# EAGLE design main (EAGLE 9.5.1)
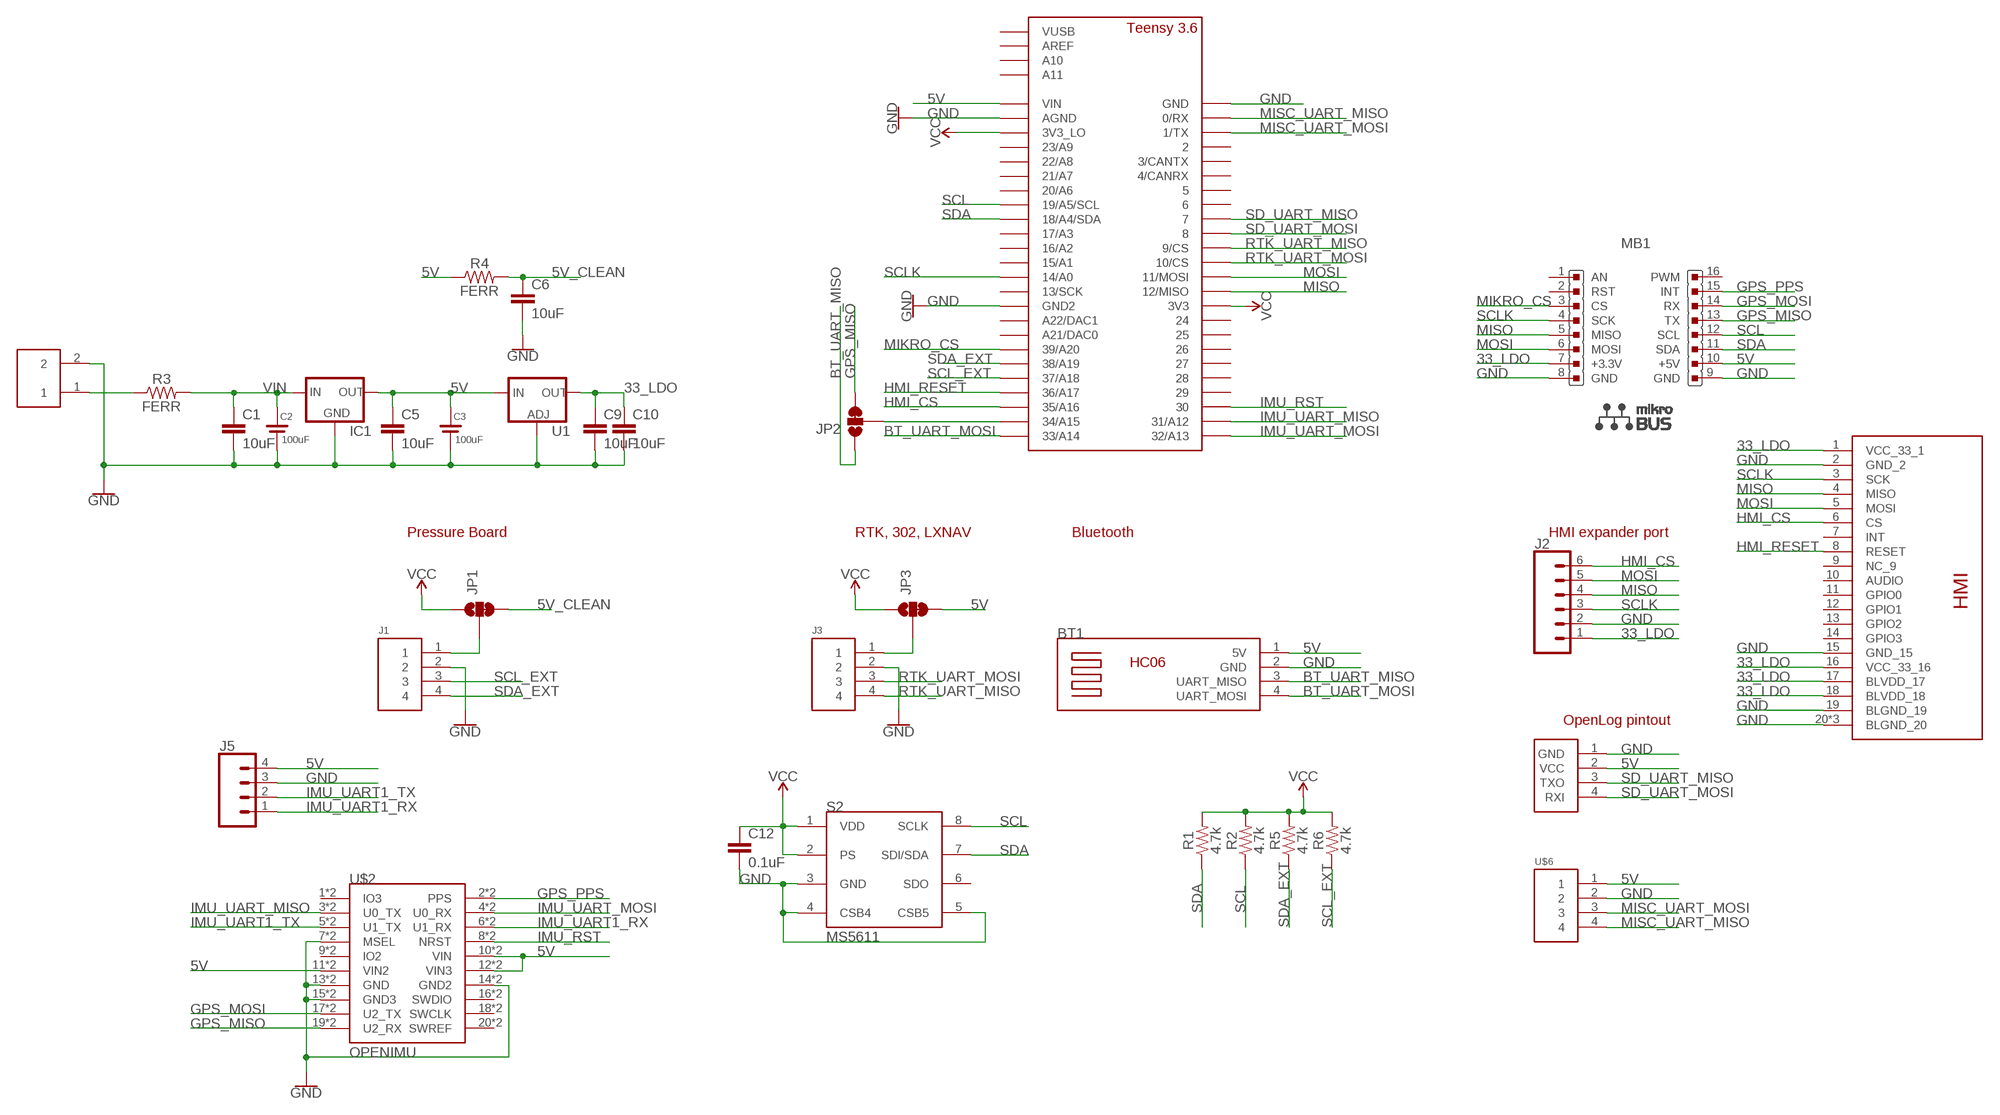
[diagram p0: schematic, sheet 1]

## Parts
BT1  HC06  [HC06]
C1  10uF  10UF-1206-6.3V-20%  [1206]
C2  100uF  CAP_POLARCAP_8_DIA_35_LEAD  [CAP_8MM_35MM]
C3  100uF  CAP_POLARCAP_8_DIA_35_LEAD  [CAP_8MM_35MM]
C5  10uF  10UF-1206-6.3V-20%  [1206]
C6  10uF  10UF-1206-6.3V-20%  [1206]
C9  10uF  10UF-1206-6.3V-20%  [1206]
C10  10uF  10UF-1206-6.3V-20%  [1206]
C12  0.1uF  0.1UF-0603-25V-5%  [0603]
IC1  V_REG_78XXR-78E  [V78W]
J1  HEADER4VALULOK  [4PINVALULOK]
J2  CONN_06SILK_FEMALE_PTH  [1X06]
J3  HEADER4VALULOK  [4PINVALULOK]
J5  CONN_04SMD_RA_FEMALE  [1X04_SMD_RA_FEMALE]
J_PWR  HEADER2  [2PINVALULOK]
JP1  JUMPER-SMT_3_1-NC_TRACE_SILK  [SMT-JUMPER_3_1-NC_TRACE_SILK]
JP2  JUMPER-SMT_3_1-NC_TRACE_NO-SILK  [SMT-JUMPER_3_1-NC_TRACE_NO-SILK]
JP3  JUMPER-SMT_3_1-NC_TRACE_SILK  [SMT-JUMPER_3_1-NC_TRACE_SILK]
MB1  MIKROBUS  [MIKROBUS]
R1  4.7k  4.7KOHM-0603-1/10W-1%  [0603]
R2  4.7k  4.7KOHM-0603-1/10W-1%  [0603]
R3  FERR  RESISTOR1206  [1206]
R4  FERR  RESISTOR1206  [1206]
R5  4.7k  4.7KOHM-0603-1/10W-1%  [0603]
R6  4.7k  4.7KOHM-0603-1/10W-1%  [0603]
S2  MS5611  [MS5611]
U1  V_REG_317SMD  [SOT223]
U$1  TEENSY_3.5/3.6_BASIC  [TEENSY_3.5/3.6_BASIC]
U$2  OPENIMU  [OPENIMU300ZA]
U$4  OPENLOG  [OPENLOG]
U$5  RIVERDI-MATRIX-HMI  [FFC-20]
U$6  HEADER4VALULOK  [4PINVALULOK]

## Nets
5V: BT1.1(5V) C3.POS(+) C5.1 IC1.OUT J5.4 JP3.3 MB1.10(+5V) R4.1 U1.3(IN) U$1.VIN U$2.10(VIN) U$2.11(VIN2) U$2.12(VIN3) U$2.H10(VIN) U$2.H11(VIN2) U$2.H12(VIN3) U$4.2(VCC) U$6.1
5V_CLEAN: C6.1 JP1.3 R4.2
33_LDO: C9.1 C10.1 J2.1 MB1.7(+3.3V) U1.2(OUT) U$5.1(VCC_33_1) U$5.16(VCC_33_16) U$5.17(BLVDD_17) U$5.18(BLVDD_18)
BT_UART_MISO: BT1.3(UART_MISO) JP2.1
BT_UART_MOSI: BT1.4(UART_MOSI) U$1.33/A14
GND: BT1.2(GND) C1.2 C2.NEG(-) C3.NEG(-) C5.2 C6.2 C9.2 C10.2 C12.2 IC1.GND J1.2 J2.2 J3.2 J5.3 J_PWR.2 MB1.8(GND) MB1.9(GND) S2.3(GND) S2.4(CSB4) S2.5(CSB5) U1.1(ADJ) U$1.AGND U$1.GND U$1.GND2 U$2.7(MSEL) U$2.13(GND) U$2.14(GND2) U$2.15(GND3) U$2.H7(MSEL) U$2.H13(GND) U$2.H14(GND2) U$2.H15(GND3) U$4.1(GND) U$5.2(GND_2) U$5.15(GND_15) U$5.19(BLGND_19) U$5.20(BLGND_20) U$5.PAD1(BLGND_20) U$5.PAD2(BLGND_20) U$6.2
GPS_MISO: JP2.3 MB1.13(TX) U$2.19(U2_RX) U$2.H19(U2_RX)
GPS_MOSI: MB1.14(RX) U$2.17(U2_TX) U$2.H17(U2_TX)
GPS_PPS: MB1.15(INT) U$2.2(PPS) U$2.H2(PPS)
HMI_CS: J2.6 U$1.35/A16 U$5.6(CS)
HMI_RESET: U$1.36/A17 U$5.8(RESET)
IMU_RST: U$1.30 U$2.8(NRST) U$2.H8(NRST)
IMU_UART1_RX: J5.1 U$2.6(U1_RX) U$2.H6(U1_RX)
IMU_UART1_TX: J5.2 U$2.5(U1_TX) U$2.H5(U1_TX)
IMU_UART_MISO: U$1.31/A12 U$2.3(U0_TX) U$2.H3(U0_TX)
IMU_UART_MOSI: U$1.32/A13 U$2.4(U0_RX) U$2.H4(U0_RX)
MIKRO_CS: MB1.3(CS) U$1.39/A20
MISC_UART_MISO: U$1.0/RX U$6.4
MISC_UART_MOSI: U$1.1/TX U$6.3
MISO: J2.4 MB1.5(MISO) U$1.12/MISO U$5.4(MISO)
MOSI: J2.5 MB1.6(MOSI) U$1.11/MOSI U$5.5(MOSI)
N$1: J_PWR.1 R3.1
N$2: J1.1 JP1.2
N$3: J3.1 JP3.2
N$4: JP2.2 U$1.34/A15
RTK_UART_MISO: J3.4 U$1.9/CS
RTK_UART_MOSI: J3.3 U$1.10/CS
SCL: MB1.12(SCL) R2.1 S2.8(SCLK) U$1.19/A5/SCL
SCL_EXT: J1.3 R6.1 U$1.37/A18
SCLK: J2.3 MB1.4(SCK) U$1.14/A0 U$5.3(SCK)
SD_UART_MISO: U$1.7 U$4.3(TXO)
SD_UART_MOSI: U$1.8 U$4.4(RXI)
SDA: MB1.11(SDA) R1.1 S2.7(SDI/SDA) U$1.18/A4/SDA
SDA_EXT: J1.4 R5.1 U$1.38/A19
VCC: C12.1 JP1.1 JP3.1 R1.2 R2.2 R5.2 R6.2 S2.1(VDD) S2.2(PS) U$1.3V3 U$1.3V3_LO
VIN: C1.1 C2.POS(+) IC1.IN R3.2
Unconnected: MB1.1(AN) MB1.2(RST) MB1.16(PWM) S2.6(SDO) U$1.2 U$1.3/CANTX U$1.4/CANRX U$1.5 U$1.6 U$1.13/SCK U$1.15/A1 U$1.16/A2 U$1.17/A3 U$1.20/A6 U$1.21/A7 U$1.21/DAC0(A21/DAC0) U$1.22/A8 U$1.23/A9 U$1.24 U$1.25 U$1.26 U$1.27 U$1.28 U$1.29 U$1.A10 U$1.A11 U$1.A22/DAC1 U$1.AREF U$1.VUSB U$2.1(IO3) U$2.9(IO2) U$2.16(SWDIO) U$2.18(SWCLK) U$2.20(SWREF) U$2.H1(IO3) U$2.H9(IO2) U$2.H16(SWDIO) U$2.H18(SWCLK) U$2.H20(SWREF) U$5.7(INT) U$5.9(NC_9) U$5.10(AUDIO) U$5.11(GPIO0) U$5.12(GPIO1) U$5.13(GPIO2) U$5.14(GPIO3)

## Notes on the sheet
- Pressure Board | RTK, 302, LXNAV | Bluetooth | HMI expander port
- OpenLog pintout

## Library data of the parts
BT1 = 2020:HC06
C1 C5 C6 C9 C10 = SparkFun-Capacitors:10UF: 10.0µF ceramic capacitors A capacitor is a passive two-terminal electrical component used to store electrical energy temporarily in an electric field.; PROD_ID: CAP-10057
C2 C3 = 2020:CAP_POLAR
C12 = SparkFun-Capacitors:0.1UF: 0.1µF ceramic capacitors A capacitor is a passive two-terminal electrical component used to store electrical energy temporarily in an electric field.; PROD_ID: CAP-08604
IC1 = 2018:V_REG_78XX: Voltage Regulator Standard 7805 5V regulator. IGO (Input Ground Output). Spark Fun Electronics SKU : COM-00107
J1 J3 U$6 = Custom_old:HEADER4
J2 = SparkFun-Connectors:CONN_06: Multi connection point. Often used as Generic Header-pin footprint for 0.1 inch spaced/style header connections On any of the 0.1 inch spaced packages, you can populate with these: Break Away Headers - Straight <https://www.sparkfun.com/products/116> (PRT-00116) Break Away Male Headers - Right Angle <https://www.sparkfun.com/products/553> (PRT-00553) Female Headers <https://www.sparkfun.com/products/115> (PRT-00115) Break Away Headers - Machine Pin <https://www.sparkfun.com/products/117> (PRT-00117) Break Away Female Headers - Swiss Machine Pin <https://www.sparkfun.com/products/743> (PRT-00743) Arduino Stackable Header - 6 Pin <https://www.sparkfun.com/products/9280> (PRT-09280) For SCREWTERMINALS and SPRING TERMINALS visit here: Screw Terimnals on SparkFun.com <https://www.sparkfun.com/search/results?term=Screw+Terminals> (5mm/3.5mm/2.54mm spacing) This device is also useful as a general connection point to wire up your design to another part of your project. Our various solder wires solder well into these plated through hole pads. Hook-Up Wire - Assortment (Stranded, 22 AWG) <https://www.sparkfun.com/products/11375> (PRT-11375) Hook-Up Wire - Assortment (Solid Core, 22 AWG) <https://www.sparkfun.com/products/11367> (PRT-11367) View the entire wire category on our website here <https://www.sparkfun.com/categories/141>; PROD_ID: CONN-08437
J5 = SparkFun-Connectors:CONN_04: Multi connection point. Often used as Generic Header-pin footprint for 0.1 inch spaced/style header connections On any of the 0.1 inch spaced packages, you can populate with these: Break Away Headers - Straight <https://www.sparkfun.com/products/116> (PRT-00116) Break Away Male Headers - Right Angle <https://www.sparkfun.com/products/553> (PRT-00553) Female Headers <https://www.sparkfun.com/products/115> (PRT-00115) Break Away Headers - Machine Pin <https://www.sparkfun.com/products/117> (PRT-00117) Break Away Female Headers - Swiss Machine Pin <https://www.sparkfun.com/products/743> (PRT-00743) For SCREWTERMINALS and SPRING TERMINALS visit here: Screw Terimnals on SparkFun.com <https://www.sparkfun.com/search/results?term=Screw+Terminals> (5mm/3.5mm/2.54mm spacing) This device is also useful as a general connection point to wire up your design to another part of your project. Our various solder wires solder well into these plated through hole pads. Hook-Up Wire - Assortment (Stranded, 22 AWG) <https://www.sparkfun.com/products/11375> (PRT-11375) Hook-Up Wire - Assortment (Solid Core, 22 AWG) <https://www.sparkfun.com/products/11367> (PRT-11367) View the entire wire category on our website here <https://www.sparkfun.com/categories/141> Special notes: Molex polarized connector foot print use with SKU : PRT-08231 with associated crimp pins and housings. 1MM SMD Version SKU: PRT-10208; PROD_ID: CONN-12382
J_PWR = Custom_old:HEADER2
JP1-JP3 = SparkFun-Jumpers:JUMPER-SMT_3_1-NC_TRACE: Normally closed trace jumper (1 of 2 connections) This jumper has a trace between two pads so it's normally closed (NC). The other connection is normally open (NO). Use a razor knife to open the connection. For best results follow the IPC guidelines for cutting traces: Cutout at least 0.063 mm (0.005 in). Remove all loose material to clean up the cut area. Seal the cut with an approved epoxy. Reapply solder to reclose the connection, or to close the NO connection.
MB1 = MikroBUS:MIKROBUS: MikroBUS Source: MikroBUS specification <http://www.mikroe.com/downloads/get/1737/mikrobus_specification.pdf> MikroBUS <http://www.mikroe.com/mikrobus/>
R1 R2 R5 R6 = SparkFun-Resistors:4.7KOHM: 4.7kΩ resistor A resistor is a passive two-terminal electrical component that implements electrical resistance as a circuit element. Resistors act to reduce current flow, and, at the same time, act to lower voltage levels within circuits. - Wikipedia; PROD_ID: RES-07857
R3 R4 = SparkFun-Resistors:RESISTOR: Generic Resistor Package
S2 = Custom_old:MS5611
U1 = SparkFun-IC-Power:V_REG_317: Voltage Regulator Standard LM317 adjustable voltage regulator. AOI (Adjust Output Input). Google 'LM317 Calculator' for easy to use app to get the two resistor values needed. 240/720 for 5V output. 240/390 for 3.3V output. Spark Fun Electronics SKU : COM-00527
U$1 = Teensy356:TEENSY_3.5/3.6_BASIC
U$2 = 2020:OPENIMU
U$4 = 2020:OPENLOG
U$5 = 2020:RIVERDI-MATRIX-HMI

## Board
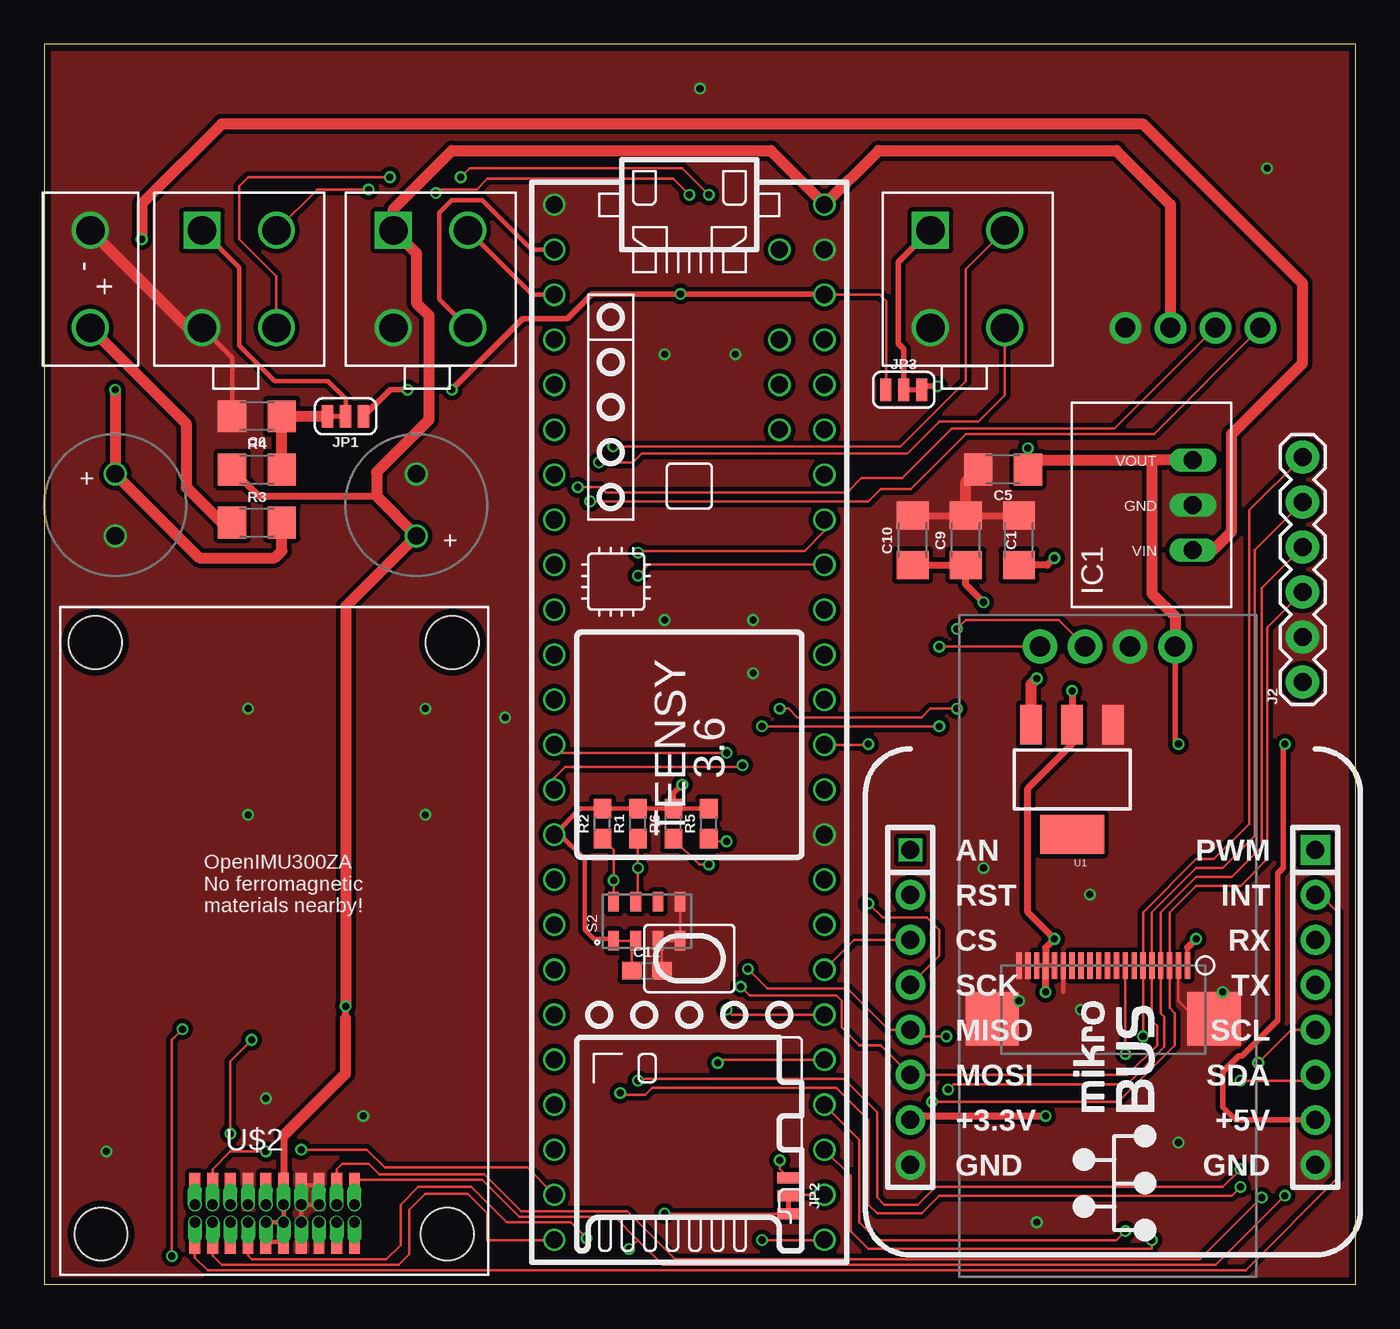
[diagram p1: board, top side]
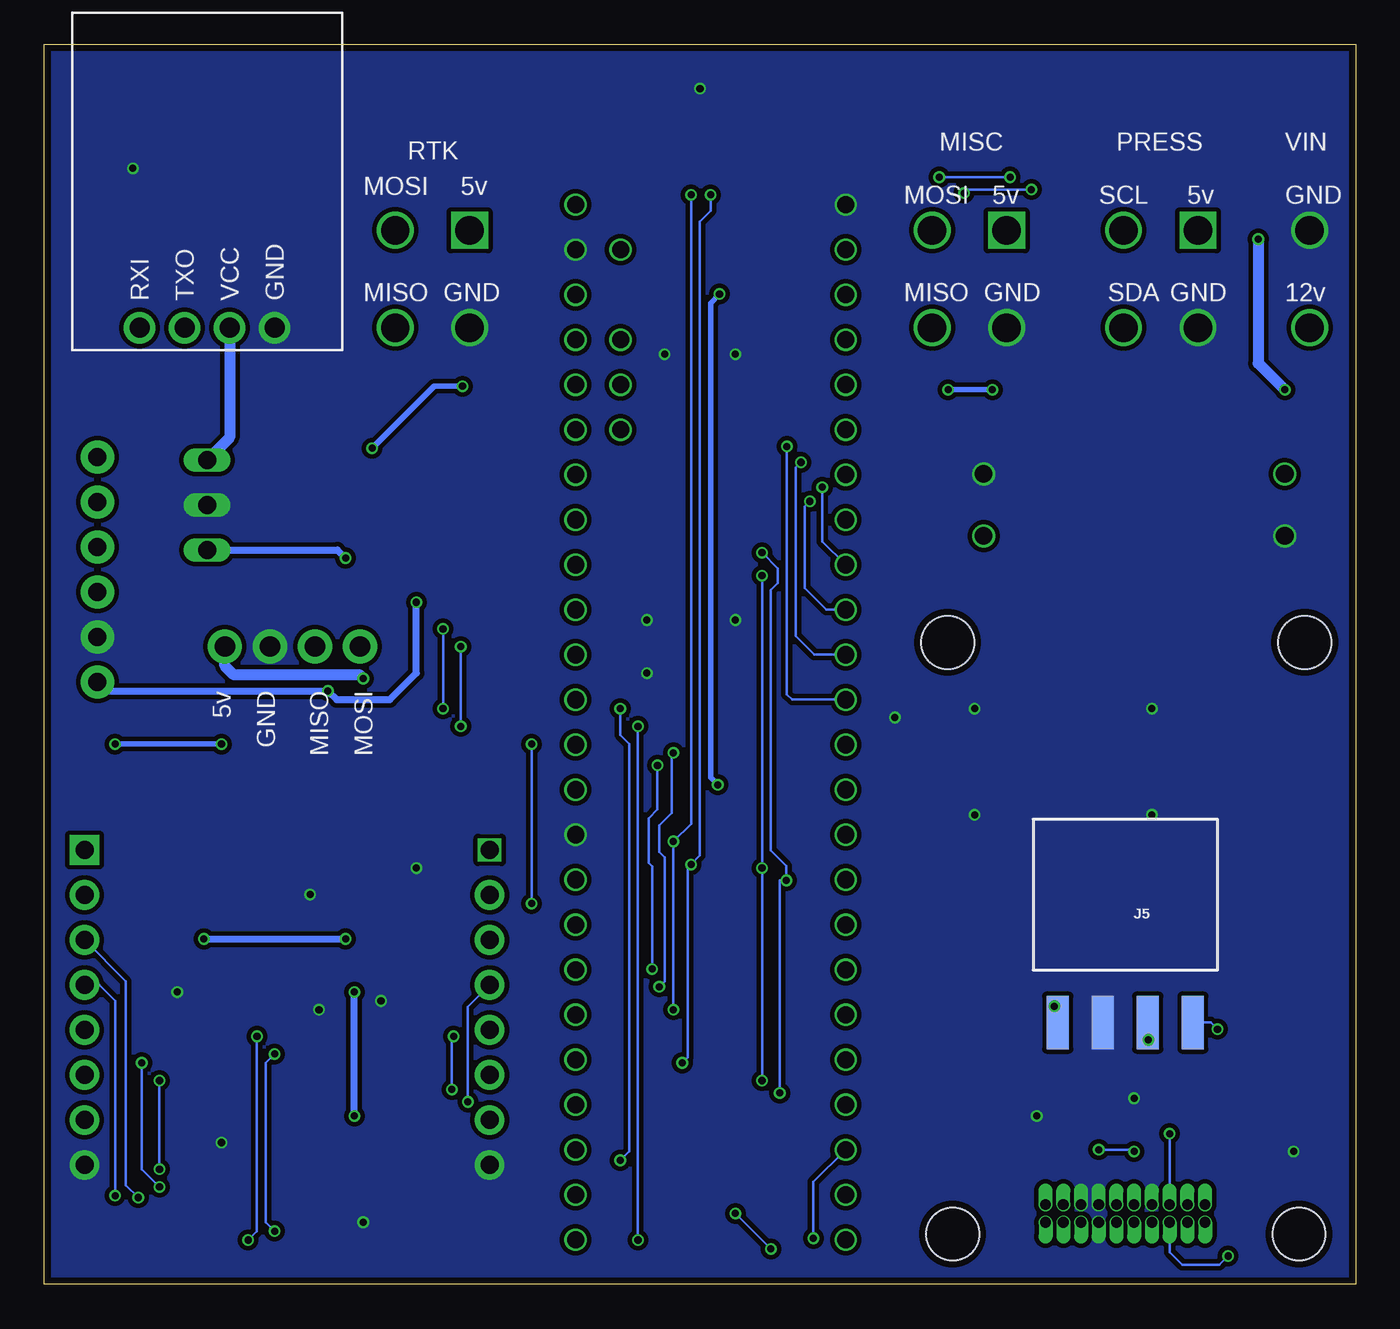
[diagram p2: board, bottom side, seen from below]

Size 74 x 70 mm. Coordinates in mm from the lower left corner, seen from the top.
Outline: 0,0 74,0 74,70 0,70 0,0
Copper layers (1*16): Top 0.035559375mm / dielectric 1.6mm / Bottom 0.035559375mm
Design rules "PATRICK-2lyr": minimum track width 6mil, minimum drill 10mil, track to track 6mil, track to pad 6mil, pad to pad 6mil, via to via 6mil, smd to smd 6mil, copper to edge 15mil, drill to drill 6mil, minimum pad ring 4mil, minimum via ring 5mil, stop-mask expansion 2.5mil, vias tented up to drill 25mil, thermal gap 10mil

### Footprints (pad centres in the part's own frame; a part is rotated, then mirrored left to right if it is on the bottom)
HC06 = drill 1.143 pad 1.93: 1 -3.81,0; 2 -1.27,0; 3 1.27,0; 4 3.81,0
1206 = smd 1.6 x 1.8: 1 -1.4,0; 2 1.4,0
CAP_8MM_35MM = drill 1: NEG 0,-1.75; POS 0,1.75
0603 = smd 1.1 x 1: 1 -0.85,0; 2 0.85,0
V78W = drill 1.016 long: GND 0,-3.81; IN -2.54,-3.81; OUT 2.54,-3.81
4PINVALULOK = drill 1.6 square: 1 0,5.5 | drill 1.6: 2 0,0; 3 4.2,5.5; 4 4.2,0
1X06 = drill 1.016 pad 1.88: 1 0,0; 2 2.54,0; 3 5.08,0; 4 7.62,0; 5 10.16,0; 6 12.7,0
1X04_SMD_RA_FEMALE = smd 1.25 x 3: 1 -3.81,7.225; 2 -1.27,7.225; 3 1.27,7.225; 4 3.81,7.225
2PINVALULOK = drill 1.6: 1 0,5.5; 2 0,0
SMT-JUMPER_3_1-NC_TRACE_SILK = smd 0.635 x 1.27: 1 -1.016,0; 2 0,0; 3 1.016,0
SMT-JUMPER_3_1-NC_TRACE_NO-SILK = smd 0.635 x 1.27: 1 -1.016,0; 2 0,0; 3 1.016,0
MIKROBUS = drill 1.016 square: 1 -11.43,7.62 | drill 1.016 pad 1.676: 2 -11.43,5.08; 3 -11.43,2.54; 4 -11.43,0; 5 -11.43,-2.54; 6 -11.43,-5.08; 7 -11.43,-7.62; 8 -11.43,-10.16; 9 11.43,-10.16; 10 11.43,-7.62; 11 11.43,-5.08; 12 11.43,-2.54; 13 11.43,0; 14 11.43,2.54; 15 11.43,5.08 | drill 1.016 pad 1.676 square: 16 11.43,7.62
MS5611 = smd 1.1 x 0.6: 1 -1.1,1.875; 2 -1.1,0.625; 3 -1.1,-0.625; 4 -1.1,-1.875; 5 1.1,-1.875; 6 1.1,-0.625; 7 1.1,0.625; 8 1.1,1.875
SOT223 = smd 1.219 x 2.235: 1 -2.311,-3.099; 2 0,-3.099; 3 2.311,-3.099 | smd 3.6 x 2.2: 4 0,3.099
TEENSY_3.5/3.6_BASIC = drill 0.965: 0/RX -25.4,-7.62; 1/TX -22.86,-7.62; 2 -20.32,-7.62; 3/CANTX -17.78,-7.62; 3V3 7.62,-7.62; 3V3_LO -22.86,7.62; 4/CANRX -15.24,-7.62; 5 -12.7,-7.62; 6 -10.16,-7.62; 7 -7.62,-7.62; 8 -5.08,-7.62; 9/CS -2.54,-7.62; 10/CS 0,-7.62; 11/MOSI 2.54,-7.62; 12/MISO 5.08,-7.62; 13/SCK 5.08,7.62; 14/A0 2.54,7.62; 15/A1 0,7.62; 16/A2 -2.54,7.62; 17/A3 -5.08,7.62; 18/A4/SDA -7.62,7.62; 19/A5/SCL -10.16,7.62; 20/A6 -12.7,7.62; 21/A7 -15.24,7.62; 21/DAC0 12.7,7.62; 22/A8 -17.78,7.62; 23/A9 -20.32,7.62; 24 10.16,-7.62; 25 12.7,-7.62; 26 15.24,-7.62; 27 17.78,-7.62; 28 20.32,-7.62; 29 22.86,-7.62; 30 25.4,-7.62; 31/A12 27.94,-7.62; 32/A13 30.48,-7.62; 33/A14 30.48,7.62; 34/A15 27.94,7.62; 35/A16 25.4,7.62; 36/A17 22.86,7.62; 37/A18 20.32,7.62; 38/A19 17.78,7.62; 39/A20 15.24,7.62; A10 -17.78,5.08; A11 -15.24,5.08; A22/DAC1 10.16,7.62; AGND -25.4,7.62; AREF -20.32,5.08; GND -27.94,-7.62; GND2 7.62,7.62; VIN -27.94,7.62; VUSB -25.4,5.08
OPENIMU300ZA = smd 0.61 x 1.372: 1 -4.503,1.6; 2 -4.503,-1.6; 3 -3.503,1.6; 4 -3.503,-1.6; 5 -2.502,1.6; 6 -2.502,-1.6; 7 -1.501,1.6; 8 -1.501,-1.6; 9 -0.5,1.6; 10 -0.5,-1.6; 11 0.5,1.6; 12 0.5,-1.6; 13 1.501,1.6; 14 1.501,-1.6; 15 2.502,1.6; 16 2.502,-1.6; 17 3.503,1.6; 18 3.503,-1.6; 19 4.503,1.6; 20 4.503,-1.6 | drill 0.6 pad 0.7 offset: H1 -4.5,0.5; H2 -4.5,-0.5; H3 -3.5,0.5; H4 -3.5,-0.5; H5 -2.5,0.5; H6 -2.5,-0.5; H7 -1.5,0.5; H8 -1.5,-0.5; H9 -0.5,0.5; H10 -0.5,-0.5; H11 0.5,0.5; H12 0.5,-0.5; H13 1.5,0.5; H14 1.5,-0.5; H15 2.5,0.5; H16 2.5,-0.5; H17 3.5,0.5; H18 3.5,-0.5; H19 4.5,0.5; H20 4.5,-0.5 | hole 3: 9.75,-1.16; -9.8,-1.16; -10.125,32.24; 10.025,32.24
OPENLOG = drill 1.143 pad 1.778: 1 0,0; 2 -2.54,0; 3 -5.08,0; 4 -7.62,0
FFC-20 = smd 0.3 x 1.5: 1 9.5,0; 2 9,0; 3 8.5,0; 4 8,0; 5 7.5,0; 6 7,0; 7 6.5,0; 8 6,0; 9 5.5,0; 10 5,0; 11 4.5,0; 12 4,0; 13 3.5,0; 14 3,0; 15 2.5,0; 16 2,0; 17 1.5,0; 18 1,0; 19 0.5,0; 20 0,0 | smd 3 x 3: PAD1 -1.5,-3; PAD2 11,-3

### Placement (x,y rotation side)
BT1  60,36 180 top
C1  55,42 90 top
C2  4,44 0 top
C3  21,44 180 top
C5  54.1,46 180 top
C6  12,49 180 top
C9  52,42 90 top
C10  49,42 90 top
C12  34,17.7 0 top
IC1  61,44 90 top
J1  8.9,54 0 top
J2  71,34 90 top
J3  50,54 0 top
J5  13,22 180 bottom
J_PWR  2.6,59.5 180 top
JP1  17,49 180 top
JP2  42,5 270 top
JP3  48.5,50.5 0 top
MB1  60.3,16.9 0 top
R1  33.5,26 90 top
R2  31.5,26 90 top
R3  12,43 0 top
R4  12,46 0 top
R5  37.5,26 90 top
R6  35.5,26 90 top
S2  34,20.5 90 top
U1  58,28.5 180 top
U$1  36.4,33 270 top
U$2  13,4 0 top
U$4  61,54 0 bottom
U$5  55,18 0 top
U$6  19.7,54 0 top

### Tracks (layer width: path | path; a pad name or v marks a point on that pad's centre or on a via)
5V  (via drill 0.4)
  Top 0.254: U$2.10 U$2.12 U$2.H12 | U$2.H11 13.5,5 U$2.11 | U$2.H11 | U$2.H11 U$2.H12 | U$2.H10 U$2.H12 | U$2.H12 | C5.1 55.5,46.54 56.04,46.54
  Top 0.305: 44.02,60.98 U$1.VIN | MB1.10 67.22,9.28 66.5,10 66.5,12 67.4,12.9 67.6,12.9 69.6,14.9 69.6,23.2 69.9,23.5 69.9,30.4 v70,30.5 | v64,30.5 63.81,30.69 BT1.1 | JP3.3 49.72,50.7 v50.4,50.7 | v55.5,47.2 C5.1
  Top 0.406: R4.1 12.1,44.5 18.75,44.5 | 13.5,8.4 13.5,5 | 13.5,5 | 17,15 v17,15.7
  Top 0.61: 44.02,60.98 41,64 23,64 19.7,60.7 U$6.1 21,58.2 21,55.4 21.7,54.7 21.7,48.8 18.75,45.85 18.75,44.5 C3.POS 17,38.25 v17,15.7 | 13.5,8.4 17,11.9 17,15 | IC1.OUT 62.54,46.54 | 62.54,46.54 62.5,46.5 62.5,39 63.81,37.69 BT1.1 | U1.3 55.69,33.89 v56,34.2 | U$1.VIN 47.08,64 60.5,64 63.54,60.96 U$4.2 | 56.04,46.54 62.54,46.54
  Bottom 0.305: v70,30.5 v64,30.5 | v50.4,50.7 52,50.7 v55.5,47.2
  Bottom 0.406: J5.4 16.81,15.51 v17,15.7
  Bottom 0.61: v56,34.2 56.2,34.4 63.3,34.4 63.81,34.91 BT1.1 | U$4.2 63.54,47.81 IC1.OUT
5V_CLEAN
  Top 0.61: R4.2 C6.1 JP1.3
33_LDO  (via drill 0.4)
  Top 0.254: U$5.16 U$5.17 U$5.18 | U$5.1 64.5,19 | 58,30.5 58,31.5 U1.2
  Top 0.406: MB1.7 49.09,9.5 v56.5,9.5 | v56.5,16.5 U$5.17 56.5,19 v57,19.5 55.5,21 55.5,28 58,30.5 | 64.5,19 v65,19.5 | v58,33.5 58,31.5 | C10.1 C9.1 52,39.5 v53,38.5
  Bottom 0.406: v56.5,9.5 v56.5,16.5 | v65,19.5 v57,19.5 | J2.1 70.5,33.5 v58,33.5 57.5,33 54.5,33 53,34.5 v53,38.5
BT_UART_MISO  (via drill 0.4)
  Top 0.152: JP2.1 41.5,6.52 v41.5,7 | v41.5,32.5 42,32.5 42.5,32 49.5,32 50,32.5 v51.5,32.5 | v51.5,37 52,37.5 57.23,37.5 BT1.3
  Bottom 0.152: v41.5,7 41,7.5 41,30.5 41.5,31 v41.5,32.5 | v51.5,32.5 v51.5,37
BT_UART_MOSI  (via drill 0.4)
  Top 0.152: U$1.33/A14 44,2.5 v40.5,2.5 | v40.5,31.5 v50.5,31.5 | v50.5,36 BT1.4
  Bottom 0.152: v40.5,2.5 v40.5,31.5 | v50.5,31.5 v50.5,36
GND  (via drill 0.4)
  Top 0.152: U$5.2 64,16 65,15 U$5.PAD2 | C12.2 34.85,19.18 S2.3 S2.4 S2.5
  Top 0.254: J1.2 10.6,52.3 C6.2 | U$2.14 U$2.13 U$2.15 U$2.H15 U$2.H13 | U$2.7 U$2.H7 | U$5.15 57.5,16.5
  Top 0.406: C10.2 C9.2 | C9.2 C1.2 | C1.2 55.4,43.4 55.5,43.5 55.1,43.5 C1.2 | 51.6,43.8 C9.2
  Top 0.61: J_PWR.2 8.1,54 J1.2 | C9.2 52,45.3 C5.2
  other vias: 11.5,32.5 21.5,32.5 21.5,26.5 11.5,26.5 35,37.5 40,37.5 37,67.5 53,23.5 59,22 64,8 26,32 40,34.5 35,52.5 39,52.5 69,63 12.5,10.5 18,9.5 3.5,7.5 56,3.5 55,16 58.5,15.5 66.5,16.5
  pour Bottom (isolate 0.254, no thermals): -0.5,70.5 74.5,70.5 74.5,-0.5 -0.5,-0.5
  pour Top (isolate 0.254, no thermals): -1,71 75,71 75,-1 -1,-1
GPS_MISO  (via drill 0.4)
  Top 0.152: U$2.H19 U$2.19 17.8,5.9 24.7,5.9 26.8,3.81 32.2,3.81 33.5,2.5 | 33.5,2.5 34.91,1.09 66.09,1.09 v70,5 | JP2.3 35.02,3.98 v35,4 | v33,2 33.5,2.5
  Bottom 0.152: v70,5 70,16 70.9,16.9 MB1.13 | v35,4 v33,2
GPS_MOSI  (via drill 0.4)
  Top 0.152: U$2.H17 U$2.17 16.5,6.5 16.8,6.8 18.3,6.8 18.89,6.21 24.83,6.21 26.92,4.11 32.89,4.11 35.6,1.4 65.2,1.4 v68.7,4.9
  Bottom 0.152: v68.7,4.9 69.4,5.6 69.4,17.11 MB1.14
GPS_PPS
  Top 0.152: U$2.2 8.5,1.5 9.21,0.79 67.79,0.79 73,6 73,21 72.02,21.98 MB1.15
  Top 0.254: U$2.2 U$2.H2
HMI_CS  (via drill 0.4)
  Top 0.152: J2.6 68,43.7 68,26 66,24 65,24 62,21 U$5.6 v62,14 | U$1.35/A16 45.5,6.12 45.5,3 46.5,2 62.5,2 v62.5,2.5
  Bottom 0.152: v62.5,2.5 62,3 v62,14
HMI_RESET  (via drill 0.4)
  Top 0.152: U$5.8 v61,13 | v61,3 60.5,2.5 47,2.5 46,3.5 46,8.16 U$1.36/A17
  Bottom 0.152: v61,13 61.5,12.5 61.5,3.5 v61,3
IMU_RST  (via drill 0.4)
  Top 0.152: U$2.8 11.5,1.6 11.7,1.4 19.3,1.4 20.1,2.2 20.1,4.5 21.1,5.5 24.1,5.5 26.1,3.5 29.7,3.5 v30.6,2.6
  Top 0.254: U$2.8 U$2.H8
  Bottom 0.152: v30.6,2.6 30.6,5.78 U$1.30
IMU_UART1_RX  (via drill 0.4)
  Top 0.152: v7.2,1.6 7.2,13.8 v7.8,14.4
  Top 0.254: U$2.6 U$2.H6
  Bottom 0.152: U$2.H6 10.5,1.8 9.8,1.1 7.7,1.1 v7.2,1.6 | v7.8,14.4 8.18,14.78 J5.1
IMU_UART1_TX  (via drill 0.4)
  Top 0.152: v10.5,8.5 10.5,12.6 v11.7,13.8
  Top 0.254: U$2.5 U$2.H5
  Bottom 0.152: U$2.H5 v10.5,8.5 | v11.7,13.8 11.7,14.74 J5.2
IMU_UART_MISO  (via drill 0.4)
  Top 0.152: v14.5,7.6 18.2,7.6 19.2,6.6 27.24,6.6 U$1.31/A12 | U$2.3 9.5,6.5 10.5,7.5 v12.5,7.5
  Top 0.254: U$2.H3 U$2.3
  Bottom 0.152: v12.5,7.5 12.6,7.6 v14.5,7.6
IMU_UART_MOSI
  Top 0.152: U$2.4 9.5,1.6 10.01,1.09 18,1.09 18.5,1.09 20,1.09 20.6,1.7 20.6,4.2 21.5,5.1 23.9,5.1 25,4 25,2.5 28.76,2.5 U$1.32/A13
  Top 0.254: U$2.4 U$2.H4
MIKRO_CS
  Top 0.152: U$1.39/A20 45.7,19.44 MB1.3
MISC_UART_MISO
  Top 0.254: U$6.4 22.3,55.6 22.3,60.5 23,61.2 24.7,61.2 27.5,58.4 U$1.0/RX
MISC_UART_MOSI
  Top 0.254: U$6.3 27.54,55.86 U$1.1/TX
MISO  (via drill 0.4)
  Top 0.152: J2.4 68.69,39.31 68.69,24.7 67,23 65,23 63,21 U$5.4 63,15.3 63.2,15.1 63.2,13.4 61.1,11.3 51.3,11.3 v51,11 | v50.9,14 49.23,14 MB1.5 47.64,14.36 45.3,16.7 40.8,16.7 v39.7,17.8 | v39.4,29.3 39.3,29.2 29.4,29.2 28.78,28.58 U$1.12/MISO
  Bottom 0.152: v51,11 51,13.9 v50.9,14 | v39.7,17.8 39.7,23.6 39.9,23.8 39.9,26.3 39.4,26.8 v39.4,29.3
MOSI  (via drill 0.4)
  Top 0.152: J2.5 68.3,41.46 68.3,25.3 66.5,23.5 65,23.5 62.5,21 U$5.5 62.5,14.9 62.8,14.6 62.8,13.5 61.12,11.82 MB1.6 47.19,13.5 46,13.5 45,14.5 45,16 44.7,16.3 39.8,16.3 v39.3,16.8 | v38.5,30 29.24,30 U$1.11/MOSI
  Bottom 0.152: v38.5,30 38.6,29.9 38.6,26.6 39.3,25.9 39.3,24.4 39,24.1 39,17.1 v39.3,16.8
N$1
  Top 0.254: 10,43 R3.1
  Top 0.61: J_PWR.1 8,48.6 8,45 10,43
N$2
  Top 0.254: J1.1 11,57.4 11,53 13,51 16,51 17,50 JP1.2
N$3
  Top 0.305: J3.1 48.2,57.7 48.2,53.1 48.5,52.8 JP3.2
N$4
  Top 0.152: JP2.2 42.06,5.06 U$1.34/A15
RTK_UART_MISO  (via drill 0.4)
  Top 0.152: J3.4 54.2,50.2 52.7,48.7 50.5,48.7 48.7,46.9 33.7,46.9 33.2,46.4 v31.3,46.4
  Bottom 0.152: U$1.9/CS 30.54,35.54 31.6,36.6 31.6,46.1 v31.3,46.4
RTK_UART_MOSI  (via drill 0.4)
  Top 0.152: J3.3 52,57.3 52,51 48.3,47.3 v32.1,47.3
  Bottom 0.152: v32.1,47.3 32.1,33.3 31.8,33 U$1.10/CS
SCL  (via drill 0.4)
  Top 0.152: MB1.12 70.36,14.36 v68.5,12.5 | v67.5,5.5 67,5 50.5,5 49.5,4 47,4 46.5,4.5 46.5,9.3 44.7,11.1 34.3,11.1 33.9,10.7 32.6,10.7 v32.5,10.8 | S2.8 v32.12,22.8 32.12,24.52 R2.1 | v33.5,41.3 33.6,41.4 42.9,41.4 44.02,42.52 U$1.19/A5/SCL
  Bottom 0.152: v68.5,12.5 68.5,6.5 v67.5,5.5 | v32.5,10.8 32.5,22.8 v32.12,22.8 32.12,23.62 33,24.5 33,39.2 32.6,39.6 32.6,40.4 v33.5,41.3
SCL_EXT  (via drill 0.4)
  Top 0.152: U$1.37/A18 38.18,12.68 v38,12.5 | v37.5,23.7 36.95,23.7 R6.1 | J1.3 15.4,61.8 v18.3,61.8 | v22.1,61.6 22.3,61.8 24.4,61.8 25,62.4 35.5,62.4 v36.4,61.5
  Bottom 0.152: v38,12.5 37.7,12.8 37.7,23.5 v37.5,23.7 37,24.2 37,60 36.4,60.6 v36.4,61.5 | v18.3,61.8 21.9,61.8 v22.1,61.6
SCLK  (via drill 0.4)
  Top 0.152: J2.3 69,37.08 69,24 67.5,22.5 65,22.5 63.5,21 U$5.3 63.5,15.6 63.8,15.3 63.8,13.5 60.6,10.3 v50.1,10.3 | MB1.4 50.5,18.53 50.5,20 49.8,20.7 47.3,20.7 v46.5,21.5 | v46.5,30.5 46.46,30.46 U$1.14/A0
  Bottom 0.152: v50.1,10.3 50.1,15.67 MB1.4 | v46.5,21.5 v46.5,30.5
SD_UART_MISO  (via drill 0.4)
  Top 0.152: U$4.3 60.38,48.3 51.2,48.3 48.4,45.5 46.1,45.5 45.3,44.7 31.7,44.7 31.4,45 v30.1,45
  Bottom 0.152: U$1.7 30.1,41.94 v30.1,45
SD_UART_MOSI  (via drill 0.4)
  Top 0.152: U$4.4 62.62,48 52,48 48.9,44.9 47.2,44.9 46.5,44.2 v30.8,44.2
  Bottom 0.152: v30.8,44.2 31.1,43.9 31.1,39.3 29.88,38.08 U$1.8
SDA  (via drill 0.4)
  Top 0.152: MB1.11 71.41,11.5 v67.5,11.5 | v67.5,6.5 66.5,5.5 50.3,5.5 49.3,4.5 47.4,4.5 47,4.9 47,9.7 45.1,11.6 33.6,11.6 v33.5,11.5 | R1.1 v33.5,23.5 33.5,21.73 S2.7 | v33.5,40 34.12,40.62 U$1.18/A4/SDA
  Bottom 0.152: v67.5,11.5 v67.5,6.5 | v33.5,11.5 v33.5,23.5 v33.5,40
SDA_EXT  (via drill 0.4)
  Top 0.152: U$1.38/A19 38.78,15.22 v38.5,15.5 | v38.5,25 37.65,25 R5.1 | v37.5,61.5 36,63 24,63 v23.5,62.5 | v19.5,62.5 11.5,62.5 11,62 11,59 13.1,56.9 J1.4
  Bottom 0.152: v38.5,15.5 v38.5,25 37.5,26 v37.5,61.5 | v23.5,62.5 v19.5,62.5
VCC  (via drill 0.4)
  Top 0.152: S2.1 S2.2 33.15,19.18 C12.1 | JP3.1 47.49,50.51 47.5,50.52 47.5,55.5 47.14,55.86 U$1.3V3_LO
  Top 0.254: S2.1 32.02,19.5 31,19.5 30.5,20 30.5,24 29.12,25.38 U$1.3V3 30.25,26.85 R2.2 R1.2 R6.2 R5.2
  Top 0.305: R6.2 35.5,27.7 v36,28.2 | U$1.3V3_LO 43.98,55.9 v35.9,55.9 30.9,55.9 29.5,54.5 27,54.5 v23,50.5 | JP1.1 19.52,50.5 v20.5,50.5
  Bottom 0.305: v36,28.2 36.4,28.6 36.4,55.4 v35.9,55.9 | v20.5,50.5 v23,50.5
VIN  (via drill 0.4)
  Top 0.406: v57,41 56.6,40.6 C1.1
  Top 0.61: R3.2 13.4,41.4 13,41 8.75,41 C2.POS v4,50.5 | IC1.IN 65.96,41.46 67,42.5 67,48 71,52 71,56.5 62,65.5 10,65.5 5.5,61 v5.5,59
  Bottom 0.406: IC1.IN 57.46,41.46 v57,41
  Bottom 0.61: v5.5,59 5.5,52 v4,50.5

### Text on the board
tPlace: + | +
bPlace: VIN | PRESS | MISC | RTK | 5v | MOSI | GND | 5v | SCL | 5v | MOSI | 12v | GND | SDA | GND | MISO | GND | MISO | MOSI | MISO | GND | 5v